# EAGLE design master-noavr (EAGLE 7.0.0)
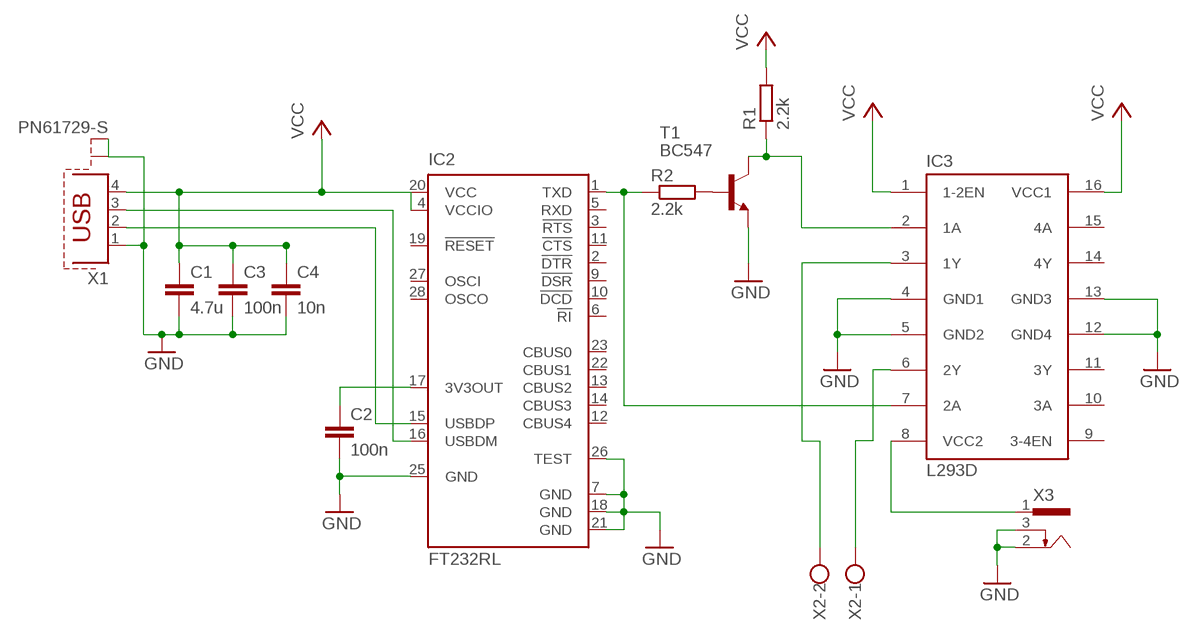
[diagram p0: schematic, sheet 1]

## Parts
C1  4.7u  C-EU025-025X050  [C025-025X050]
C2  100n  C-EU025-025X050  [C025-025X050]
C3  100n  C-EU025-025X050  [C025-025X050]
C4  10n  C-EU025-025X050  [C025-025X050]
IC2  FT232RL  [SSOP28]
IC3  L293D  [DIL16]
R1  2.2k  R-EU_0309/10  [0309/10]
R2  2.2k  R-EU_0309/10  [0309/10]
T1  BC547  [TO92]
X1  PN61729-S  [PN61729-S]
X2  W237-102  [W237-102]
X3  733980-62  [733980-62]

## Nets
GND: C1.2 C2.2 C3.2 C4.2 IC2.7(GND) IC2.18(GND) IC2.21(GND) IC2.25(GND) IC2.26(TEST) IC3.4(GND1) IC3.5(GND2) IC3.12(GND4) IC3.13(GND3) T1.1(E) X1.1 X1.S1 X1.S2 X3.2 X3.3
N$1: IC2.1(TXD) IC3.7(2A) R2.1
N$2: IC2.16(USBDM) X1.3
N$3: IC2.15(USBDP) X1.2
N$4: C2.1 IC2.17(3V3OUT)
N$5: R2.2 T1.2(B)
N$7: IC3.8(VCC2) X3.1
N$12: IC3.2(1A) R1.1 T1.3(C)
N$14: IC3.3(1Y) X2.2
N$15: IC3.6(2Y) X2.1
VCC: C1.1 C3.1 C4.1 IC2.4(VCCIO) IC2.20(VCC) IC3.1(1-2EN) IC3.16(VCC1) R1.2 X1.4
Unconnected: IC2.2(!DTR) IC2.3(!RTS) IC2.5(RXD) IC2.6(!RI) IC2.9(!DSR) IC2.10(!DCD) IC2.11(!CTS) IC2.12(CBUS4) IC2.13(CBUS2) IC2.14(CBUS3) IC2.19(!RESET) IC2.22(CBUS1) IC2.23(CBUS0) IC2.27(OSCI) IC2.28(OSCO) IC3.9(3-4EN) IC3.10(3A) IC3.11(3Y) IC3.14(4Y) IC3.15(4A)

## Library data of the parts
C1-C4 = resistor:C-EU: CAPACITOR, European symbol
IC2 = ftdichip:FT232R: Source: http://www.ftdichip.com/Documents/DataSheets/DS_FT232R_v104.pdf; MPN: FT232RL; OC_FARNELL: 1146032; OC_NEWARK: 91K9918
IC3 = st-microelectronics:L293D: PUSH-PULL 4 CHANNEL DRIVER; MPN: L293D; OC_FARNELL: 9589619; OC_NEWARK: 56P8249
R1 R2 = resistor:R-EU_: RESISTOR, European symbol
T1 = transistor:BC547: NPN TRANSISTOR
X1 = con-berg:PN61729-S: BERG USB connector; OC_FARNELL: unknown; OC_NEWARK: unknown
X2 = con-wago-500:W237-102: WAGO SCREW CLAMP; MPN: 237-102; OC_FARNELL: unknown; OC_NEWARK: 70K9898
X3 = con-conrad:73398?: FEMALE PRINT CONNECTOR Niedervolt-Steckverbinder Distributor Conrad

## Board
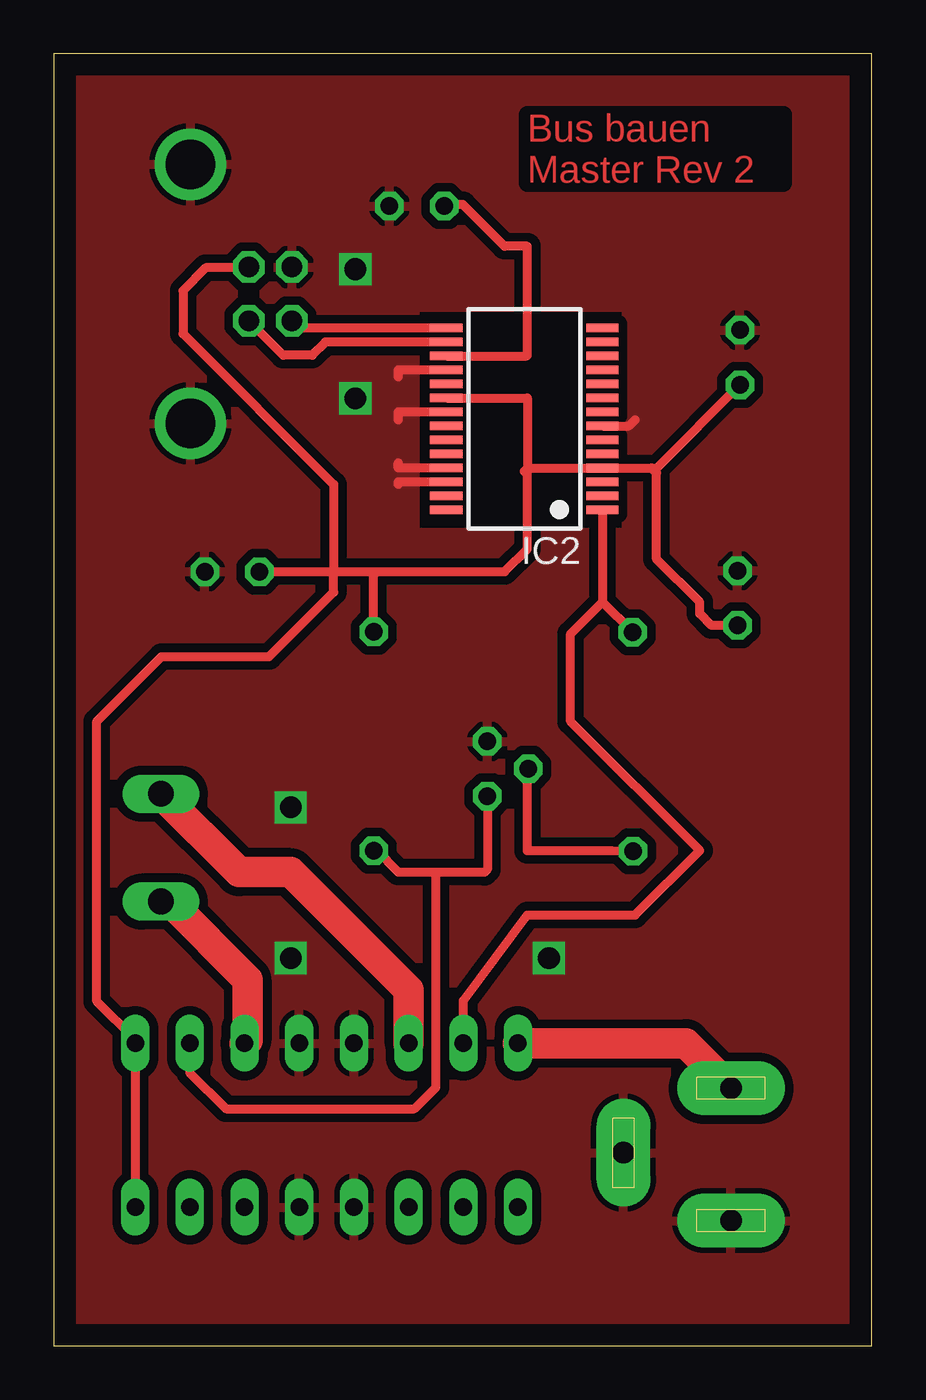
[diagram p1: board, top side]
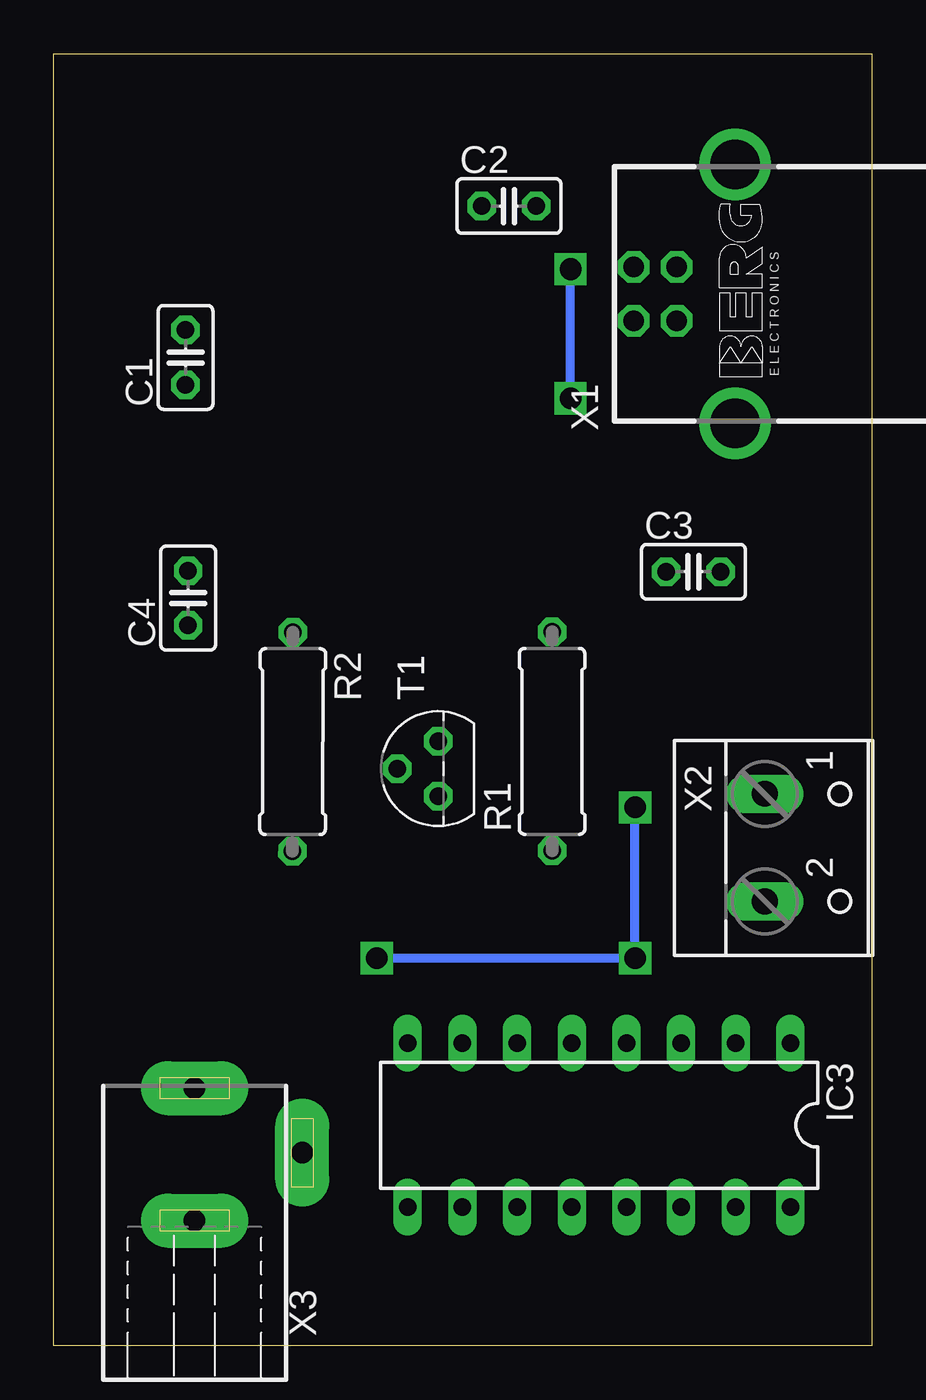
[diagram p2: board, bottom side, seen from below]

Size 38 x 60 mm. Coordinates in mm from the lower left corner, seen from the top.
Outline: 0,0 38,0 38,60 0,60 0,0
Copper layers (1*16): Top 0.035mm / dielectric 1.5mm / Bottom 0.035mm
Design rules "default": minimum track width 10mil, minimum drill 24mil, track to track 8mil, track to pad 8mil, pad to pad 8mil, via to via 8mil, smd to smd 8mil, copper to edge 40mil, drill to drill 8mil, minimum pad ring 10mil, minimum via ring 8mil, stop-mask expansion 4mil, vias tented up to drill 0mil, thermal gap 10mil

### Footprints (pad centres in the part's own frame; a part is rotated, then mirrored left to right if it is on the bottom)
C025-025X050 = drill 0.813 octagon: 1 -1.27,0; 2 1.27,0
SSOP28 = smd 0.4 x 1.5: 1 -4.225,-3.625; 2 -3.575,-3.625; 3 -2.925,-3.625; 4 -2.275,-3.625; 5 -1.625,-3.625; 6 -0.975,-3.625; 7 -0.325,-3.625; 8 0.325,-3.625; 9 0.975,-3.625; 10 1.625,-3.625; 11 2.275,-3.625; 12 2.925,-3.625; 13 3.575,-3.625; 14 4.225,-3.625; 15 4.225,3.625; 16 3.575,3.625; 17 2.925,3.625; 18 2.275,3.625; 19 1.625,3.625; 20 0.975,3.625; 21 0.325,3.625; 22 -0.325,3.625; 23 -0.975,3.625; 24 -1.625,3.625; 25 -2.275,3.625; 26 -2.925,3.625; 27 -3.575,3.625; 28 -4.225,3.625
DIL16 = drill 0.813 long: 1 -8.89,-3.81; 2 -6.35,-3.81; 3 -3.81,-3.81; 4 -1.27,-3.81; 5 1.27,-3.81; 6 3.81,-3.81; 7 6.35,-3.81; 8 8.89,-3.81; 9 8.89,3.81; 10 6.35,3.81; 11 3.81,3.81; 12 1.27,3.81; 13 -1.27,3.81; 14 -3.81,3.81; 15 -6.35,3.81; 16 -8.89,3.81
0309/10 = drill 0.813 octagon: 1 -5.08,0; 2 5.08,0
TO92 = drill 0.813 octagon: 1 1.27,0; 2 0,1.905; 3 -1.27,0
PN61729-S = drill 0.95 octagon: 1 1.25,4.71; 2 -1.25,4.71; 3 -1.25,2.71; 4 1.25,2.71 | drill 2.3 pad 2.9: S1 -6.02,0; S2 6.02,0
W237-102 = drill 1.194 long: 1 -2.5,-1.27; 2 2.5,-1.27
733980-62 = drill 1 pad 2.5 long: 1 0,8.57; 2 0,2.42; 3 5,5.57

### Placement (x,y rotation side)
C1  31.88,45.9 90 bottom
C2  16.86,52.93 0 bottom
C3  8.29,35.95 0 bottom
C4  31.76,34.72 90 bottom
IC2  21.86,43.04 90 top
IC3  12.67,10.24 180 bottom
R1  14.86,28.07 90 bottom
R2  26.9,28.05 269.9 bottom
T1  20.14,26.8 90 bottom
X1  6.35,48.85 90 bottom
X2  3.7,23.13 270 bottom
X3  31.46,3.39 0 bottom

### Tracks (layer width: path | path; a pad name or v marks a point on that pad's centre or on a via)
GND  (via drill 1)
  Top 0.406: IC2.7 26.71,42.72 27,43 | 11.06,50 X1.1 | IC2.18 16,45.31 16,45 | IC2.26 16,40.12 16,40 | IC2.25 16,40.77 16,41 | IC2.21 16,43.36 16,43
  Bottom 0.406: v14,44 v14,50 | v11,25 v11,18 v23,18
  pour Top (isolate 0.406): 0,60 38,60 38,0 0,0
N$1
  Top 0.406: IC2.1 25.48,34.54 | 25.48,34.54 R2.1 | 25.48,34.54 24,33.06 24,29 30,23 27,20 22,20 19.02,16.02 IC3.7
N$2
  Top 0.406: IC2.16 12.62,46.61 12,46 10.66,46 X1.3
N$3
  Top 0.406: IC2.15 11.39,47.27 X1.2
N$4
  Top 0.406: IC2.17 21.96,45.97 22,46 22,51.06 20.94,51.06 19,53 18.2,53 C2.1
N$5
  Top 0.406: R2.2 25.91,23 22,23 22,26.76 T1.2
N$6
  cutout Top (isolate 0.406, rank 2): 17,48 26.36,48 26.36,38 17,38
N$7
  Top 1.422: IC3.8 29.37,14.05 X3.1
N$12
  Top 0.406: T1.3 20.14,22.13 20,21.99 19.99,22 17.75,22 | R1.1 15.01,22.99 16,22 17.75,22 | IC3.2 6.32,12.68 8,11 16.75,11 17.75,12 17.75,22
N$14
  Top 1.422: X2.2 5.37,20.63 9,17 9,14.19 IC3.3
N$15
  Top 1.422: IC3.6 16.48,16.52 11,22 8.6,22 X2.1
VCC
  Top 0.406: IC2.20 22,44.02 22,40.75 | 22,40.75 25.48,40.75 IC2.4 27.77,40.77 | 22,40.75 21.86,40.6 22,40.46 22,37 20.95,35.95 15,35.95 | C3.1 13,35.95 | 13,35.95 15,35.95 | 27.77,40.77 28,40.53 28,36.53 30,34.53 30,34 30.55,33.45 C4.1 | R1.2 14.86,35.8 15,35.95 | 27.77,40.77 28.02,40.77 C1.1 | X1.4 9.06,50.06 7.06,50.06 6,49 6,47 13,40 13,35.95 | IC3.16 IC3.1 3.78,14.22 2,16 2,29 5,32 10,32 13,35 13,35.95

### Text on the board
Top: Bus bauen / Master Rev 2